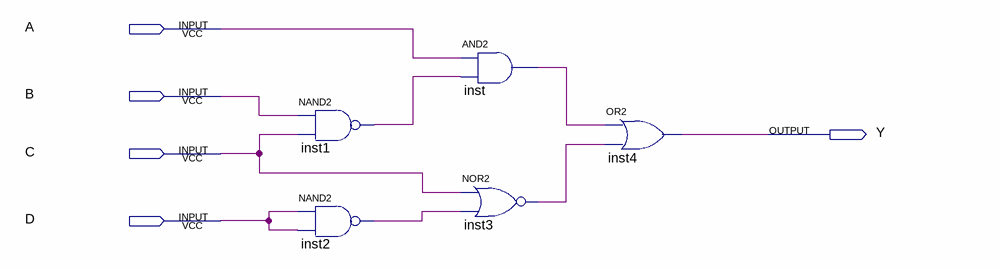
[diagram p0: schematic sheet]
// Quartus schematic Design1_Gudmundsson.bdf as structural Verilog: 5 symbols, 5 pins
module Design1_Gudmundsson (
  input  A,
  input  B,
  input  C,
  input  D,
  output Y
);

  wire inst1_out, inst2_out, inst3_out, inst_out;

  nand inst1 (inst1_out, B, C);
  nand inst2 (inst2_out, D, D);
  and inst (inst_out, A, inst1_out);
  nor inst3 (inst3_out, C, inst2_out);
  or inst4 (Y, inst_out, inst3_out);
endmodule
